# EAGLE design SENSOR_PANEL (EAGLE 8.5.1)
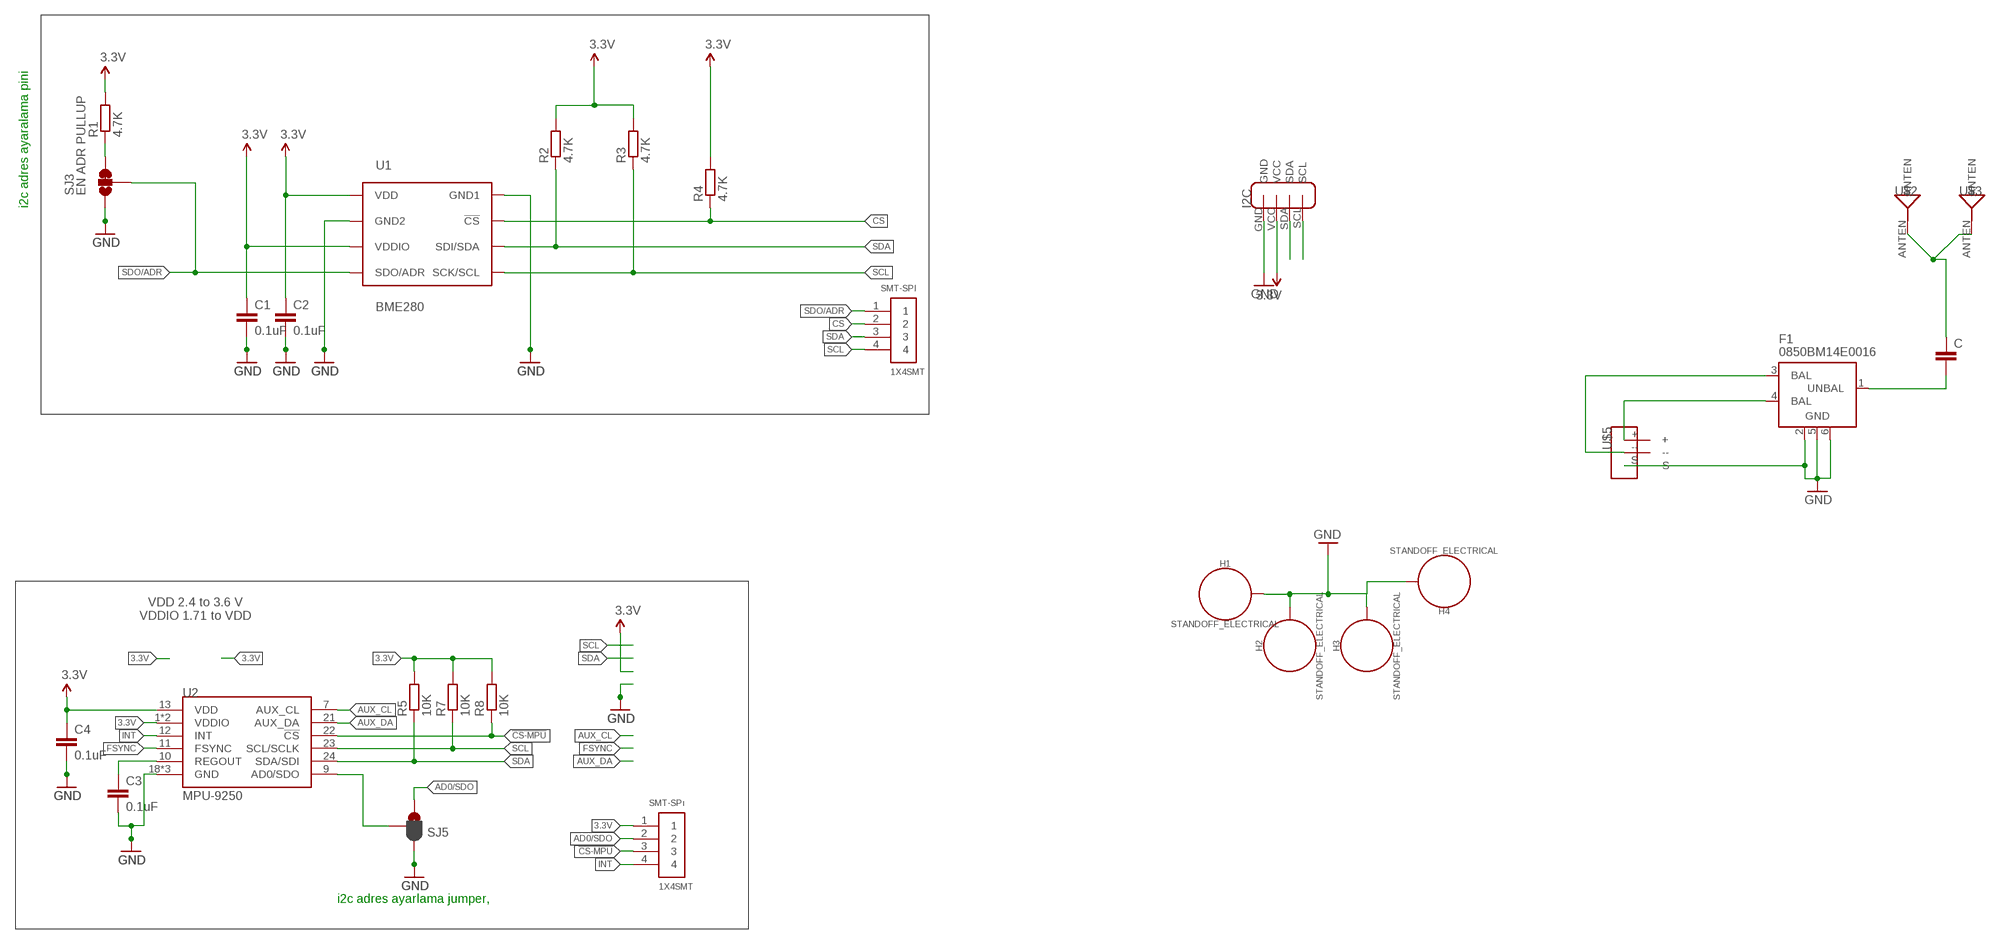
[diagram p0: schematic, sheet 1]

## Parts
C  C-EUC0805  [C0805]
C1  0.1uF  C-EUC0805  [C0805]
C2  0.1uF  C-EUC0805  [C0805]
C3  0.1uF  C-EUC0805  [C0805]
C4  0.1uF  C-EUC0805  [C0805]
F1  0850BM14E0016  2450BM15A0002  [2450BM15A0002]
H1  STANDOFF_ELECTRICAL  [STANDOFF-ELECTRICAL]
H2  STANDOFF_ELECTRICAL  [STANDOFF-ELECTRICAL]
H3  STANDOFF_ELECTRICAL  [STANDOFF-ELECTRICAL]
H4  STANDOFF_ELECTRICAL  [STANDOFF-ELECTRICAL]
R1  4.7K  R-EU_R0805  [R0805]
R2  4.7K  R-EU_R0805  [R0805]
R3  4.7K  R-EU_R0805  [R0805]
R4  4.7K  R-EU_R0805  [R0805]
R5  10K  R-EU_R0805  [R0805]
R7  10K  R-EU_R0805  [R0805]
R8  10K  R-EU_R0805  [R0805]
SJ3  EN ADR PULLUP  JUMPER-PAD-3-2OF3_NC_BY_TRACE_SMALL  [PAD-JUMPER-3-2OF3_NC_BY_TRACE_YES_SILK_FULL_BOX]
SJ5  JUMPER_PAD-3-1&2_NC_BY_PASTE  [PAD-HUMPER-3-1&2_NC_BY_PASTE_YES_SILK_FULL_BOX]
SMT-SPI  1X4SMT  [1X4-SMT]
SMT-SPı  1X4SMT  [1X4-SMT]
U1  BME280  [BME280_LGA]
U2  MPU-9250  [QFN24_PAD]
U$1  I2C  [I2C]
U$2  ANTEN  [ANTEN]
U$3  ANTEN  [ANTEN]
U$5  3PINSENSOR  [3PINSENSOR]

## Nets
3.3V: C1.1 C2.1 C4.1 R1.2 R2.2 R3.2 R4.2 R5.2 R7.2 R8.2 SMT-SPı.1 U1.P$6(VDDIO) U1.P$8(VDD) U2.1(VDDIO) U2.8(VDDIO) U2.13(VDD) U$1.VCC
!CS-MPU: R8.1 SMT-SPı.3 U2.22(!CS)
AD0/SDO: SJ5.3 SMT-SPı.2
ADSD_STUB: SJ5.2 U2.9(AD0/SDO)
AUX_CL: U2.7(AUX_CL)
AUX_DA: U2.21(AUX_DA)
CS: R4.1 SMT-SPI.2 U1.P$2(!CS)
FSYNC: U2.11(FSYNC)
GND: C1.2 C2.2 C3.2 C4.2 F1.2(GND) F1.5(GND) F1.6(GND) H1.P1 H2.P1 H3.P1 H4.P1 SJ3.1 SJ5.1 U1.P$1(GND1) U1.P$7(GND2) U2.18(GND) U2.20(GND) U2.CENTER(GND) U$1.GND U$5.S
INT: SMT-SPı.4 U2.12(INT)
N$1: C.2 F1.1(UNBAL)
N$4: R1.1 SJ3.3
N$7: C.1 U$2.ANTEN U$3.ANTEN
N$8: F1.3(BAL) U$5.--
N$9: F1.4(BAL) U$5.+
REGOUT: C3.1 U2.10(REGOUT)
SCL: R3.1 R7.1 SMT-SPI.4 U1.P$4(SCK/SCL) U2.23(SCL/SCLK) U$1.SCL
SDA: R2.1 R5.1 SMT-SPI.3 U1.P$3(SDI/SDA) U2.24(SDA/SDI) U$1.SDA
SDO/ADR: SJ3.2 SMT-SPI.1 U1.P$5(SDO/ADR)

## Notes on the sheet
- i2c adres ayaralama pini
- VDD 2.4 to 3.6 V
  VDDIO 1.71 to VDD
- i2c adres ayarlama jumper,

## Library data of the parts
C C1-C4 = resistor:C-EU: CAPACITOR, European symbol
F1 = johanson-technology:2450BM15A0002: 2.45 GHz Impedance Matched Balun-Filter For TI CC253X/CC2540 Chipset family Data sheet <http://www.johansontechnology.com/images/stories/ip/baluns/balun_filter_combo_matched_2450bm15a0002_v8.pdf>
H1-H4 = SparkFun-Hardware:STANDOFF_ELECTRICAL: Stand Off Drill holes with an electrical connection. For example, use these to ground your board to a chassis. Example SparkFun Products Screw - Phillips Head (1/4", 4-40, 10 pack) <https://www.sparkfun.com/products/10453> (PRT-10453) Screw - Phillips Head (1/2", 4-40, 10 pack) <https://www.sparkfun.com/products/10452> (PRT-10452) Screw - Phillips Head (3/4", 4-40, 10 pack) <https://www.sparkfun.com/products/10451> (PRT-10451) Screw - Phillips Head (1", 4-40, 10 pack) <https://www.sparkfun.com/products/10450> (PRT-10450)
R1-R5 R7 R8 = resistor:R-EU_: RESISTOR, European symbol
SJ3 = SparkFun-Passives:JUMPER-PAD-3-2OF3_NC_BY_TRACE
SJ5 = SparkFun-Passives:JUMPER_PAD-3-1&2_NC_BY_PASTE
SMT-SPI SMT-SPı = adafruit:1X4: 4-pin connector
U1 = BME280ComponentLibrary:BME280; PROD_ID: IC-13090
U2 = Testing:MPU-9250: NC pin 19. 2-6 & 14-17 not internally connected. May be used for PCB trace routing.; PROD_ID: IC-13192
U$1 = 0000000111111aaa:I2C
U$2 U$3 = 0000000111111aaa:ANTEN
U$5 = 0000000111111aaa:3PINSENSOR

## Board
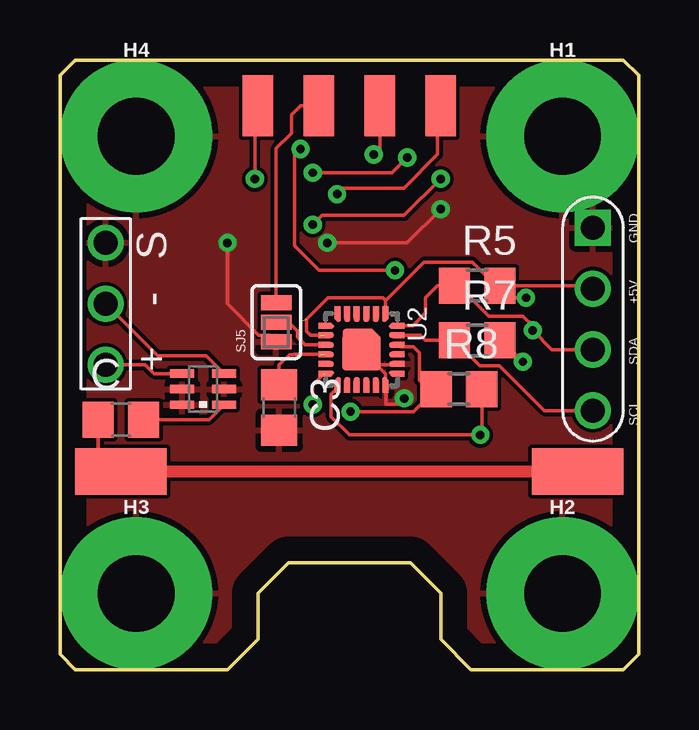
[diagram p1: board, top side]
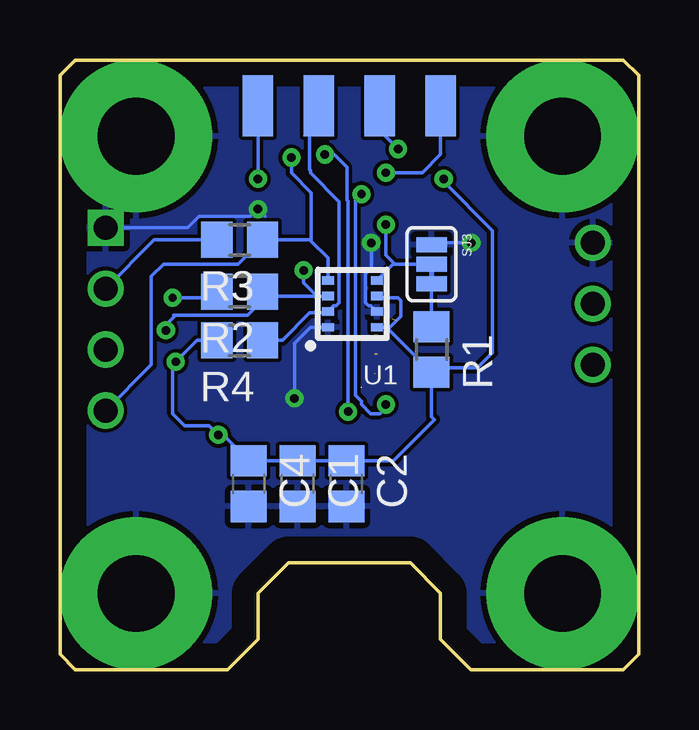
[diagram p2: board, bottom side, seen from below]

Size 24.13 x 25.4 mm. Coordinates in mm from the lower left corner, seen from the top.
Outline: 0,24.77 0.64,25.4 23.5,25.4 24.13,24.77 24.13,0.63 23.5,0 17.15,0 15.88,1.27 15.88,3.17 14.61,4.45 9.53,4.45 8.26,3.17 8.26,1.27 6.98,0 0.64,0 0,0.63 0,24.77
Copper layers (1*16): Top 0.035mm / dielectric 1.5mm / Bottom 0.035mm
Design rules "default": minimum track width 6mil, minimum drill 0.35mm, track to track 6mil, track to pad 6mil, pad to pad 6mil, via to via 6mil, smd to smd 6mil, copper to edge 40mil, drill to drill 6mil, minimum pad ring 10mil, minimum via ring 8mil, stop-mask expansion 4mil, vias tented up to drill 0mil, thermal gap 10mil

### Footprints (pad centres in the part's own frame; a part is rotated, then mirrored left to right if it is on the bottom)
C0805 = smd 1.3 x 1.5: 1 -0.95,0; 2 0.95,0
2450BM15A0002 = smd 0.35 x 1: 1 -0.65,-0.875; 2 0,-0.875; 3 0.65,-0.875; 4 0.65,0.875; 5 0,0.875; 6 -0.65,0.875
STANDOFF-ELECTRICAL = drill 3.2 pad 6.35: P1 0,0
R0805 = smd 1.3 x 1.5: 1 -0.95,0; 2 0.95,0
PAD-JUMPER-3-2OF3_NC_BY_TRACE_YES_SILK_FULL_BOX = smd 0.635 x 1.27: 1 -0.813,0; 2 0,0; 3 0.813,0
PAD-HUMPER-3-1&2_NC_BY_PASTE_YES_SILK_FULL_BOX = smd 0.635 x 1.27: 1 -0.813,0; 2 0,0; 3 0.813,0
1X4-SMT = smd 1.27 x 2.54: 1 -3.81,0; 2 -1.27,0; 3 1.27,0; 4 3.81,0
BME280_LGA = smd 0.5 x 0.35: P$1 1.025,0.975; P$2 1.025,0.325; P$3 1.025,-0.325; P$4 1.025,-0.975; P$5 -1.025,-0.975; P$6 -1.025,-0.325; P$7 -1.025,0.325; P$8 -1.025,0.975
QFN24_PAD = smd 0.5 x 0.25: 1 -1.55,1; 2 -1.55,0.6; 3 -1.55,0.2; 4 -1.55,-0.2; 5 -1.55,-0.6; 6 -1.55,-1; 13 1.55,-1; 14 1.55,-0.6; 15 1.55,-0.2; 16 1.55,0.2; 17 1.55,0.6; 18 1.55,1 | smd 0.08 x 0.13: 1$1 -1.32,1.06; 1$3 -1.26,0.94; P$33 1.26,-0.94; P$34 1.32,-1.06; P$58 1.26,0.94; P$59 1.32,1.06; P$68 -1.26,-0.94; P$69 -1.32,-1.06 | smd 0.1 x 0.185 rotated 45: 1$2 -1.25,1.024; P$49 1.024,-1.25 | smd 0.14 x 0.14: 1$4 -1.22,0.945; P$23 -0.945,-1.22; P$24 1.22,-0.945; P$36 0.945,1.22; P$51 0.945,-1.22; P$56 1.22,0.945; P$61 -0.945,1.22; P$66 -1.22,-0.945 | smd 0.05 x 0.05: 1$5 -1.175,0.97; P$25 -0.97,-1.175; P$31 1.175,-0.97; P$37 0.97,1.175; P$52 0.97,-1.175; P$57 1.175,0.97; P$62 -0.97,1.175; P$67 -1.175,-0.97 | smd 0.25 x 0.5: 7 -1,-1.55; 8 -0.6,-1.55; 9 -0.2,-1.55; 10 0.2,-1.55; 11 0.6,-1.55; 12 1,-1.55; 19 1,1.55; 20 0.6,1.55; 21 0.2,1.55; 22 -0.2,1.55; 23 -0.6,1.55; 24 -1,1.55 | smd 0.25 x 0.25: CENTER 0,0 | smd 0.4 x 0.4: DBBADFE -0.675,0.24 | smd 0.6 x 1.2: DBBADFE1 -0.575,-0.195 | smd 0.25 x 0.3: P$1 -0.2,1.3; P$3 0.2,1.3; P$5 0.6,1.3; P$11 -0.6,1.3; P$16 0.2,-1.3; P$18 -0.2,-1.3; P$20 -0.6,-1.3; P$26 0.6,-1.3 | smd 0.3 x 0.25: P$2 -1.3,0.2; P$4 -1.3,0.6; P$28 -1.3,-0.2; P$38 -1.3,-0.6; P$40 1.3,0.2; P$42 1.3,-0.2; P$44 1.3,-0.6; P$50 1.3,0.6 | smd 0.1 x 0.185 rotated 225: P$7 1.25,-1.024; P$60 -1.024,1.25 | smd 1.1 x 1.59: P$13 0.325,0 | smd 0.3 x 0.5 rotated 315: P$14 -0.592,0.512 | smd 0.5 x 1.59: P$15 -0.27,0 | smd 0.1 x 0.185 rotated 135: P$22 -1.024,-1.25; P$55 1.25,1.024 | smd 0.13 x 0.08: P$27 -0.94,-1.26; P$29 -1.06,-1.32; P$39 0.94,1.26; P$41 1.06,1.32; P$53 0.94,-1.26; P$54 1.06,-1.32; P$63 -0.94,1.26; P$64 -1.06,1.32 | smd 0.1 x 0.185 rotated 315: P$35 1.024,1.25; P$65 -1.25,-1.024
I2C = drill 1 square: GND -2.54,0 | drill 1: SCL 5.08,0; SDA 2.54,0; VCC 0,0
ANTEN = smd 1.93 x 3.81: ANTEN 0,0
3PINSENSOR = drill 1: + 2.54,0; -- 0,0; S -2.54,0

### Placement (x,y rotation side)
C  2.54,10.41 0 top
C1  14.22,7.75 270 bottom
C2  12.19,7.75 270 bottom
C3  9.14,10.92 270 top
C4  16.26,7.75 270 bottom
F1  5.97,11.68 90 top
H1  20.95,22.23 0 top
H2  20.95,3.17 0 top
H3  3.18,3.17 0 top
H4  3.18,22.23 0 top
R1  8.64,13.34 270 bottom
R2  16.64,15.75 180 bottom
R3  16.64,17.91 180 bottom
R4  16.64,13.72 180 bottom
R5  17.4,16 0 top
R7  17.4,13.72 0 top
R8  16.64,11.68 0 top
SJ3  8.64,16.89 270 bottom
SJ5  9.02,14.48 90 top
SMT-SPI  12.07,23.49 0 bottom
SMT-SPı  12.07,23.49 0 top
U1  11.94,15.24 180 bottom
U2  12.57,13.34 270 top
U$1  22.23,15.88 270 top
U$2  2.54,8.26 90 top
U$3  21.59,8.26 90 top
U$5  1.91,15.24 270 top

### Tracks (layer width: path | path; a pad name or v marks a point on that pad's centre or on a via)
3.3V  (via drill 0.35)  (3 unrouted)
  Top 0.152: U$1.VCC 22.1,16 R5.2 | v8.13,20.45 8.13,23.37 SMT-SPı.1 | R8.2 17.59,9.84 v17.53,9.78 12.07,9.78 11.3,10.54 11.3,11.48 11.57,11.75 | v19.3,12.83 18.41,13.72 R7.2 | R5.2 18.86,15.49 v19.43,15.49 | U2.1 13.57,15.37 | 13.57,15.37 13.57,15.38 13.46,15.49 11.18,15.49 10.29,14.6 10.29,14.1 10.45,13.94 10.89,13.94 | R5.2 18.17,16 17.19,16.98 15.19,16.98 13.57,15.37
  Bottom 0.152: U$1.VCC 20.19,17.91 R3.2 | R1.2 8.64,10.54 8.51,10.41 10.23,8.7 C2.1 C1.1 C4.1 17.34,9.78 v17.53,9.78 17.91,10.16 18.92,10.16 19.43,10.67 19.43,12.7 v19.3,12.83 18.41,13.72 R4.2 | R1.2 10.52,14.27 | 10.52,14.27 U1.P$8 | R1.2 8.45,12.57 6.73,12.57 6.1,13.21 6.1,18.29 8.13,20.32 v8.13,20.45 | v19.43,15.49 17.84,15.49 R2.2 | U1.P$6 10.84,15.49 10.03,15.49 9.91,15.37 9.91,14.73 10.1,14.54 10.37,14.27 10.52,14.27
!CS-MPU  (via drill 0.35)
  Top 0.152: U2.22 14.2,13.46 14.73,13.46 14.99,13.21 14.99,12.06 15.11,11.94 15.11,11.68 R8.1 14.75,10.75 v12.11,10.75 | v13.08,21.46 13.34,21.72 SMT-SPı.3
  Bottom 0.152: v12.11,10.75 12.11,19.51 12.16,19.56 12.16,19.94 12.16,20.04 12.16,20.93 12.7,21.46 v13.08,21.46
AD0/SDO
  Top 0.152: SMT-SPı.2 10.03,23.49 9.65,23.11 9.65,22.35 9.02,21.72 SJ5.3
ADSD_STUB
  Top 0.152: U2.9 10.21,13.53 9.91,13.84 9.91,14.1 9.53,14.48 SJ5.2
CS
  Bottom 0.152: SMT-SPI.2 13.72,23.11 13.72,20.83 13.69,20.8 13.69,20.7 12.48,19.5 12.48,15.3 12.62,15.16 12.72,15.16 U1.P$2 13.02,14.86 13.72,14.86 14.86,13.72 R4.1
GND  (via drill 0.35)
  Top 0.152: U2.20 14.09,12.7 13.08,12.7 13.08,12.83 U2.CENTER 13.57,12.34 U2.18 13.59,11.77 13.59,11.05 14.1,11.05 v14.35,11.3 | v15.88,19.19 14.47,17.78 v11.15,17.78 | SJ5.1 8.75,13.93 8.29,13.93 6.98,15.23 v6.98,17.78
  Bottom 0.152: v14.35,11.3 14.35,13.59 13.68,14.27 U1.P$1 | U$1.GND 18.8,18.41 18.33,18.89 16.18,18.89 v15.88,19.19 15.57,18.89 | U1.P$7 11.16,15.16 11.26,15.16 11.39,15.3 11.39,16.48 11.15,16.73 v11.15,17.78 | v6.98,17.78 8.56,17.78 SJ3.1
  pour Top: 0,24.77 0.64,25.4 23.5,25.4 24.13,24.77 24.13,0.63 23.5,0 17.15,0 15.88,1.27 15.88,3.17 14.61,4.45 9.53,4.45 8.26,3.17 8.26,1.27 6.98,0 0.64,0 0,0.63
  pour Bottom: 0.64,25.4 23.5,25.4 24.13,24.77 24.13,0.63 23.5,0 17.15,0 15.88,1.27 15.88,3.17 14.61,4.45 9.53,4.45 8.26,3.17 8.26,1.27 6.98,0 0.64,0 0,0.63 0,24.77
INT  (via drill 0.35)  (1 unrouted)
  Top 0.152: SMT-SPı.4 15.75,23.37 15.75,21.46 14.35,20.07 11.81,20.07 v11.56,19.81 | v10.54,11.05 10.54,11.85 10.98,12.3 10.98,12.34
  Bottom 0.152: v10.54,11.05 10.41,11.05 10.8,10.67 11.18,10.67 11.56,11.05 11.56,11.18 11.81,11.43 11.81,19.56 v11.56,19.81
N$1
  Top 0.152: C.2 6.22,10.41 F1.1
N$4
  Bottom 0.152: SJ3.3 R1.1
N$7
  Top 0.152: C.1 1.59,9.2 U$2.ANTEN
  Top 0.508: U$2.ANTEN U$3.ANTEN
N$8
  Top 0.152: F1.3 6.1,13.08 4.06,13.08 U$5.--
N$9
  Top 0.152: F1.4 3.92,12.33 3.56,12.7 U$5.+
REGOUT  (1 unrouted)
  Top 0.152: C3.1 9.14,12.7 9.56,13.12 9.75,13.12 9.76,13.13 10.89,13.13
SCL  (via drill 0.35)
  Top 0.152: U2.23 15.02,13.94 15.24,13.72 R7.1 17.5,12.66 18.33,12.66 20.2,10.8 U$1.SCL | v14.48,21.34 13.84,20.7 v10.54,20.7
  Bottom 0.152: U1.P$4 12.96,17.15 13.65,17.84 | 13.65,17.84 13.72,17.91 R3.1 16.7,16.89 19.81,16.89 20.32,16.38 20.32,12.7 U$1.SCL | 13.65,17.84 13.65,19.88 14.48,20.7 v14.48,21.34 | v10.54,20.7 9.02,20.7 8.26,21.46 SMT-SPI.4
SDA  (via drill 0.35)
  Top 0.152: U2.24 14.72,14.34 15.24,14.86 15.24,15.49 15.75,16 R5.1 16.63,16 17.9,14.73 19.3,14.73 19.71,14.32 v19.71,14.13 20.51,13.34 U$1.SDA | v13.97,16.64 10.8,16.64 9.78,17.65 9.78,21.44 v10.03,21.69
  Bottom 0.152: 15.5,15.56 U1.P$3 13.41,15.56 13.97,16.13 v13.97,16.64 | 15.5,15.56 R2.1 | 19.39,14.77 19.3,14.77 | 19.3,14.77 16.3,14.77 15.5,15.56 | v10.03,21.69 10.8,22.46 SMT-SPI.3 | 19.3,14.77 19.71,14.36 v19.71,14.13
SDO/ADR  (via drill 0.35)
  Top 0.152: v10.54,18.54 10.92,18.92 14.35,18.92 v15.88,20.45
  Bottom 0.152: U1.P$5 10.24,16.89 10.16,16.89 | SJ3.2 10.16,16.89 | 10.16,16.89 10.54,17.27 v10.54,18.54 | v15.88,20.45 SMT-SPI.1